# Altium schematic sheet altium.schdoc
size 209 x 65 mm
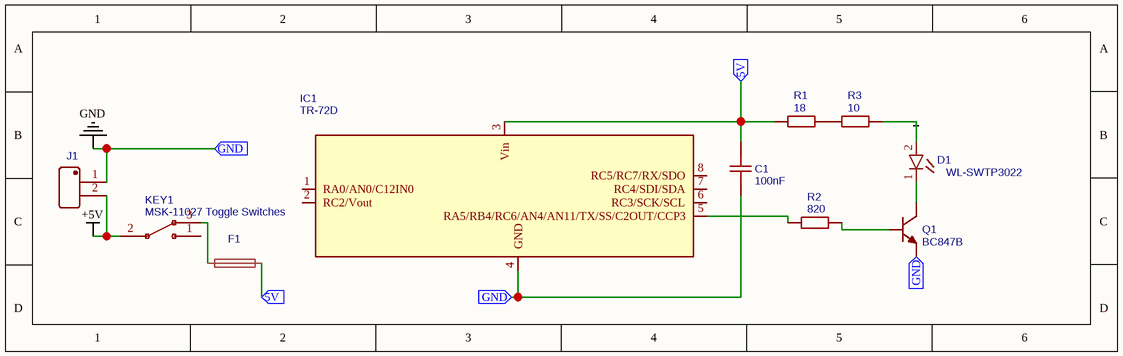
[diagram p0: altium.schdoc]

## Parts
C1  100nF  [1210]
D1  WL-SWTP3022  [WL-SWTP_3022]
F1  NO  [OMF_125]  (value not drawn)
IC1  TR-72D  [IQRF_KON-SIM-01]
J1  KF127_2P_5.08  [KF127_2P_5.08]  (value not drawn)
KEY1  MSK-11027 Toggle Switches  [MSK-11027]
Q1  BC847B  [SOT-23(SOT-23-3)]
R1  18  [1206]
R2  820  [1206]
R3  10  [1206]

## Ports
5V, GND

## Nets
+5V: J1.2(PIN2) KEY1.2
GND: C1.1 IC1.4(GND) J1.1(PIN1) Q1.2(E) ; port GND
5V: C1.2 F1.2 IC1.3(Vin) R1.1 ; port 5V
NetD1_1: D1.1 Q1.3(C)
NetD1_2: D1.2 R3.2
NetF1_1: F1.1 KEY1.3
NetIC1_5: IC1.5(RA5/RB4/RC6/AN4/AN11/TX/SS/C2OUT/CCP3) R2.1
NetQ1_1: Q1.1(B) R2.2
NetR1_2: R1.2 R3.1

Not connected (* = marked no-connect by the designer): IC1 1(RA0/AN0/C12IN0) 2(RC2/Vout) 6(RC3/SCK/SCL) 7(RC4/SDI/SDA) 8(RC5/RC7/RX/SDO); KEY1 1

## Library data of the parts
C1 = 100nF: BOM_Manufacturer: Huaxin S&T; BOM_Manufacturer Part: 1210B106K100CT; nameAlias: Capacitance; Contributor: LCSC; BOM_Supplier: LCSC; BOM_Supplier Part: C304011; spicePre: C; spiceSymbolName: 1210B106K100CT
D1 = WL-SWTP3022: forwardVoltage: 3.2V; description: WL-SWTP; spicePre: D
F1 = NO: BOM_Manufacturer Part: 3403.0015.11; Contributor: romiksm; BOM_Supplier: Mouser; BOM_Supplier Part: 693-3403.0015.11; link: https://www.mouser.co.uk/ProductDetail/Schurter/3403001511?qs=sGAEpiMZZMtxU2g%2f1juGqdRmCQF0%252bT4VUkZkHB0fJk4%3d; spicePre: F
IC1 = TR-72D: Contributor: Simen Stensas; license: https://www.gnu.org/licenses/lgpl-2.1.html; spicePre: I
J1 = KF127_2P_5.08: BOM_Manufacturer: Kefa Electronics; BOM_Manufacturer Part: KF127L-5.08; Contributor: GrahamG; spicePre: J
KEY1 = MSK-11027 Toggle Switches: BOM_Manufacturer: ReliaPro; BOM_Supplier Part: C21381; BOM_Supplier: LCSC; BOM_Manufacturer Part: MSK-11027 Toggle Switches; image: http://image.lceda.cn/szlcsc/C21381.jpg; spicePre: K
Q1 = BC847B: BOM_Manufacturer: Hottech; Contributor: LCSC; BOM_Supplier: LCSC; BOM_Manufacturer Part: BC847B; BOM_Supplier Part: C181140; spicePre: Q
R1 = 18: BOM_Manufacturer: BOURNS; BOM_Manufacturer Part: CR1206-FX-18R0ELF; nameAlias: Resistance (Ohms); Contributor: LCSC; BOM_Supplier: LCSC; BOM_Supplier Part: C204720; spicePre: R; spiceSymbolName: CR1206-FX-18R0ELF
R2 = 820: BOM_Manufacturer: ResistorToday; BOM_Manufacturer Part: AECR1206F820RK9; nameAlias: Resistance (Ohms); Contributor: LCSC; BOM_Supplier: LCSC; BOM_Supplier Part: C352031; spicePre: R; spiceSymbolName: AECR1206F820RK9
R3 = 10: BOM_Manufacturer: ResistorToday; BOM_Manufacturer Part: AECR1206F10R0K9; nameAlias: Resistance (Ohms); Contributor: LCSC; BOM_Supplier: LCSC; BOM_Supplier Part: C352161; spicePre: R; spiceSymbolName: AECR1206F10R0K9